# Altium schematic sheet CONN SEQ.SchDoc
size A; SheetNumber: 7; SheetTotal: 7
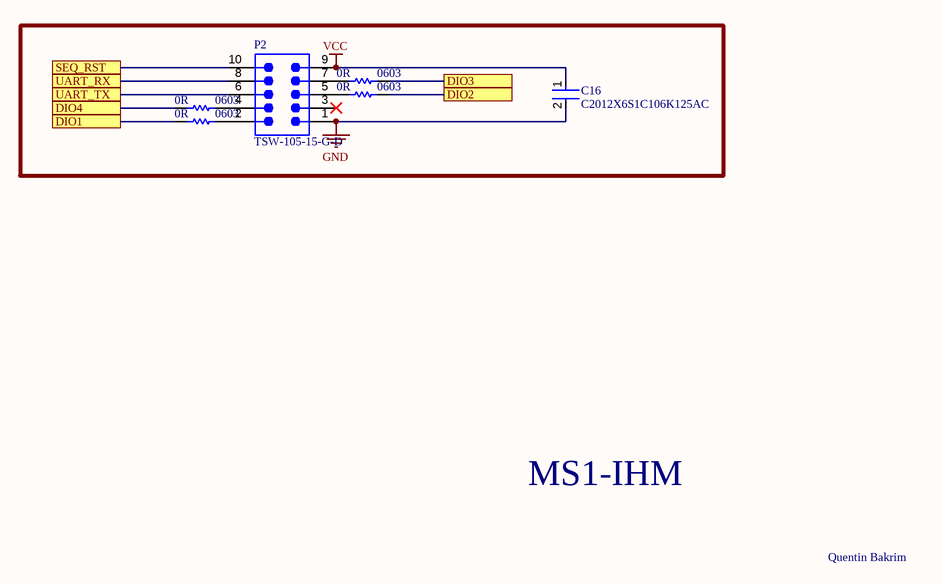
[diagram p0: CONN SEQ.SchDoc]

## Parts
C16  C2012X6S1C106K125AC  [FP-C2012-125-0_2-MFG]
P2  TSW-105-15-G-D  [SMTC-TSW-105-15-X-D]
R46  PackageReference: 0603  Resistor: 0R  [RESC1609X50X30NL8T20]  (hidden comment: CRCW06030000Z0EA)
R47  PackageReference: 0603  Resistor: 0R  [RESC1609X50X30NL8T20]  (hidden comment: CRCW06030000Z0EA)
R48  PackageReference: 0603  Resistor: 0R  [RESC1609X50X30NL8T20]  (hidden comment: CRCW06030000Z0EA)
R49  PackageReference: 0603  Resistor: 0R  [RESC1609X50X30NL8T20]  (hidden comment: CRCW06030000Z0EA)

## Ports
DIO1, DIO2, DIO3, DIO4, SEQ_RST, UART_RX, UART_TX

## Nets
GND: C16.2 P2.1
VCC: C16.1 P2.9
DIO1: R49.1 ; port DIO1
DIO2: R47.2 ; port DIO2
DIO3: R46.2 ; port DIO3
DIO4: R48.1 ; port DIO4
SEQ_RST: P2.10 ; port SEQ_RST
UART_RX: P2.8 ; port UART_RX
UART_TX: P2.6 ; port UART_TX
NetP2_2: P2.2 R49.2
NetP2_4: P2.4 R48.2
NetP2_5: P2.5 R47.1
NetP2_7: P2.7 R46.1

Not connected (* = marked no-connect by the designer): P2 3*

## Notes on the sheet
- MS1-IHM
- Quentin Bakrim

## Library data of the parts
C16 = CMP-08246-003655-1: Multilayer Ceramic Capacitors 10μF ±10% 16V X6S SMD 0805; Capacitance: 10uF; Contact Plating: Tin; Height: 1.25mm; Thickness: 0.057inch; Case Code (Metric): 2012; Dielectric Material: Ceramic; Tolerance: 10%; Depth: 1.25mm; Length: 2mm; Lead Free: Lead Free; RoHS Compliant: Yes; Case/Package: 0805; REACH SVHC: No SVHC; Construction: Flat; Voltage Rating: 16V; Max Operating Temperature: 105°C; Series: C; Width: 0.049inch; Voltage Rating (DC): 16V; Packaging: Tape and Reel; Package Quantity: 1; Min Operating Temperature: -55°C; Mount: Surface Mount; Dielectric: X6S; Case Code (Imperial): 0805
P2 = CMP-1024-00369-1: 0.025" SQ Post Header, Through-hole, Vertical, -55 to 125 degC, 2.54 mm Pitch, 10-Pin, Male, RoHS; Manufacturer: Samtec; Pitch: 2.54 mm; ComponentLink2Description: Datasheet; ComponentLink1URL: http://www.samtec.com; DatasheetVersion: F-214; ComponentLink3Description: Package Specification; PartNumber: TSW-105-15-G-D; RoHS: True; Temperature Range: -55 to 125 degC; ComponentLink3URL: http://www.samtec.com/documents/webfiles/cpdf/TSW-XXX-XX-XXX-X-XX-XXX-MKT.pdf; Orientation: Vertical; Mounting Technology: Through-hole; PackageReference: TSW-105-15-X-D; PackageVersion: DM, 8/1988; PackageDescription: .025[0.64] SQ. Post Terminal Strip Assembly; ComponentLink2URL: http://www.samtec.com/documents/webfiles/pdf/TSW_TH.PDF; ComponentLink1Description: Manufacturer URL
R46-R49 = CMP-2000-03816-5: Chip Resistor, 0 Ohm, Jumper, 100 mW, -55 to 155 degC, 0603 (1608 Metric), RoHS, Tape and Reel; Manufacturer: Vishay Semiconductor; Voltage Rating: 75 V; Package Quantity: 5000; DatasheetVersion: 06/2012; Min Operating Temperature: -55 degC; ComponentLink1URL: http://www.vishay.com/; Mounting Technology: Surface Mount; Height: 0.45 mm; ComponentLink1Description: Manufacturer URL; REACH SVHC: Unknown; Packaging: Tape and Reel; Max Operating Temperature: 155 degC; Mount: Surface Mount; ComponentLink2Description: Datasheet; PackageDescription: 2-Pin Surface Mount Device, Body 1.575 x 0.85 mm; Length: 1.55 mm; ComponentLink2URL: http://www.vishay.com/docs/20035/dcrcwe3.pdf; Pins: 2; RoHSCompliant: true